# EAGLE design CPU (EAGLE 7.1.0)
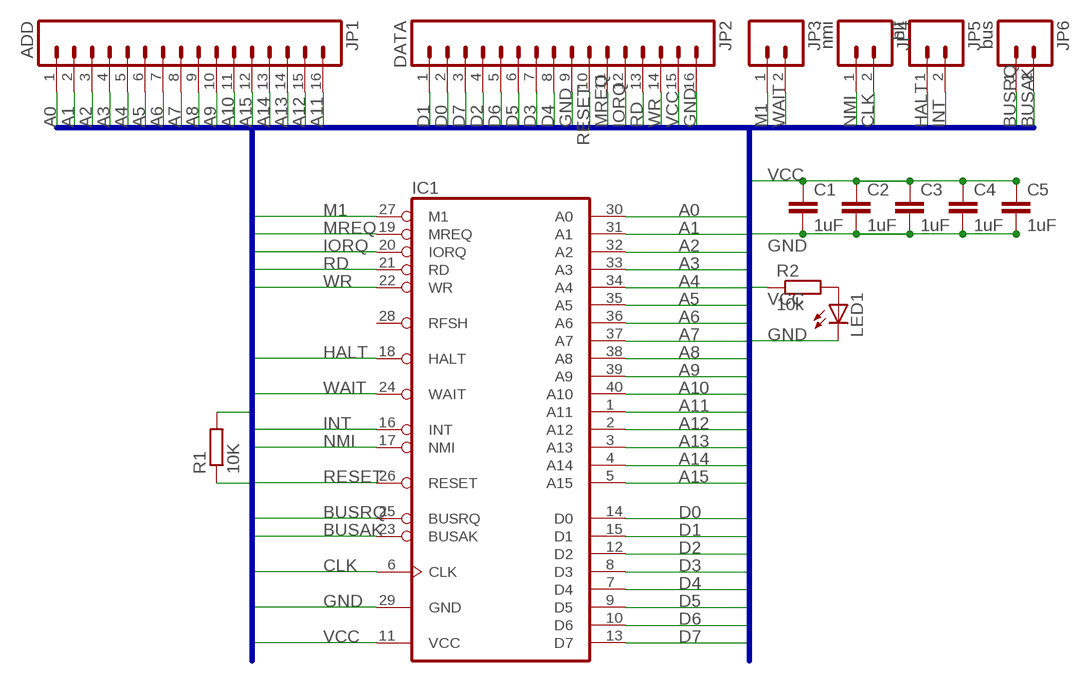
[diagram p0: schematic, sheet 1]

## Parts
C1  1uF  C-EUC0805  [C0805]
C2  1uF  C-EUC0805  [C0805]
C3  1uF  C-EUC0805  [C0805]
C4  1uF  C-EUC0805  [C0805]
C5  1uF  C-EUC0805  [C0805]
IC1  Z80CPU  [DIL40]
JP1  ADD  M16PTH  [1X16]
JP2  DATA  M16PTH  [1X16]
JP3  M02PTH  [1X02]
JP4  nmi  M02PTH  [1X02]
JP5  hlt  M02PTH  [1X02]
JP6  bus  M02PTH  [1X02]
LED1  LEDCHIP-LED0805  [CHIP-LED0805]
R1  10K  R-EU_M0805  [M0805]
R2  10k  R-EU_M0805  [M0805]

## Nets
A0: IC1.30(A0) JP1.1
A1: IC1.31(A1) JP1.2
A2: IC1.32(A2) JP1.3
A3: IC1.33(A3) JP1.4
A4: IC1.34(A4) JP1.5
A5: IC1.35(A5) JP1.6
A6: IC1.36(A6) JP1.7
A7: IC1.37(A7) JP1.8
A8: IC1.38(A8) JP1.9
A9: IC1.39(A9) JP1.10
A10: IC1.40(A10) JP1.11
A11: IC1.1(A11) JP1.16
A12: IC1.2(A12) JP1.15
A13: IC1.3(A13) JP1.14
A14: IC1.4(A14) JP1.13
A15: IC1.5(A15) JP1.12
BUSAK: IC1.23(BUSAK) JP6.2
BUSRQ: IC1.25(BUSRQ) JP6.1
CLK: IC1.6(CLK) JP4.2
D0: IC1.14(D0) JP2.2
D1: IC1.15(D1) JP2.1
D2: IC1.12(D2) JP2.4
D3: IC1.8(D3) JP2.7
D4: IC1.7(D4) JP2.8
D5: IC1.9(D5) JP2.6
D6: IC1.10(D6) JP2.5
D7: IC1.13(D7) JP2.3
GND: C1.2 C2.2 C3.2 C4.2 C5.2 IC1.29(GND) JP2.9 JP2.16 LED1.C
HALT: IC1.18(HALT) JP5.1
INT: IC1.16(INT) JP5.2
IORQ: IC1.20(IORQ) JP2.12
M1: IC1.27(M1) JP3.1
MREQ: IC1.19(MREQ) JP2.11
N$1: LED1.A R2.2
NMI: IC1.17(NMI) JP4.1
RD: IC1.21(RD) JP2.13
RESET: IC1.26(RESET) JP2.10 R1.1
VCC: C1.1 C2.1 C3.1 C4.1 C5.1 IC1.11(VCC) JP2.15 R1.2 R2.1
WAIT: IC1.24(WAIT) JP3.2
WR: IC1.22(WR) JP2.14
Unconnected: IC1.28(RFSH)

## Buses
A0,A1,A2,A3,A4,A5,A6,A7,A8,A9,A10,A11,A12,A13,A14,A15,D0,D1,D2,D3,D4,D5,D6,D7,GND,VCC,WR,RD,IORQ,MREQ,RESET,M1,CLK,WAIT,NMI,HALT,INT,BUSRQ,BUSAK

## Library data of the parts
C1-C5 = rcl:C-EU: CAPACITOR, European symbol
IC1 = zilog:Z80CPU: Z80 FAMILY DEVICE
JP1 JP2 = SparkFun-Connectors:M16: 1x16 .1" header
JP3-JP6 = SparkFun:M02: Header 2 Standard 2-pin 0.1" header. Use with straight break away headers (SKU : PRT-00116), right angle break away headers (PRT-00553), swiss pins (PRT-00743), machine pins (PRT-00117), and female headers (PRT-00115). Molex polarized connector foot print use with SKU : PRT-08233 with associated crimp pins and housings.
LED1 = adafruit:LED: LED OSRAM: - CHIPLED LG R971, LG N971, LY N971, LG Q971, LY Q971, LO R971, LY R971 LH N974, LH R974 LS Q976, LO Q976, LY Q976 LO Q996 - Hyper CHIPLED LW Q18S LB Q993, LB Q99A, LB R99A - SideLED LS A670, LO A670, LY A670, LG A670, LP A670 LB A673, LV A673, LT A673, LW A673 LH A674 LY A675 LS A676, LA A676, LO A676, LY A676, LW A676 LS A679, LY A679, LG A679 - Hyper Micro SIDELED® LS Y876, LA Y876, LO Y876, LY Y876 LT Y87S - SmartLED LW L88C, LW L88S LB L89C, LB L89S, LG L890 LS L89K, LO L89K, LY L89K LS L896, LA L896, LO L896, LY L896 - TOPLED LS T670, LO T670, LY T670, LG T670, LP T670 LSG T670, LSP T670, LSY T670, LOP T670, LYG T670 LG T671, LOG T671, LSG T671 LB T673, LV T673, LT T673, LW T673 LH T674 LS T676, LA T676, LO T676, LY T676, LB T676, LH T676, LSB T676, LW T676 LB T67C, LV T67C, LT T67C, LS T67K, LO T67K, LY T67K, LW E67C LS E67B, LA E67B, LO E67B, LY E67B, LB E67C, LV E67C, LT E67C LW T67C LS T679, LY T679, LG T679 LS T770, LO T770, LY T770, LG T770, LP T770 LB T773, LV T773, LT T773, LW T773 LH T774 LS E675, LA E675, LY E675, LS T675 LS T776, LA T776, LO T776, LY T776, LB T776 LHGB T686 LT T68C, LB T68C - Hyper Mini TOPLED® LB M676 - Mini TOPLED Santana® LG M470 LS M47K, LO M47K, LY M47K Source: http://www.osram.convergy.de/
R1 R2 = rcl:R-EU_: RESISTOR, European symbol

## Board
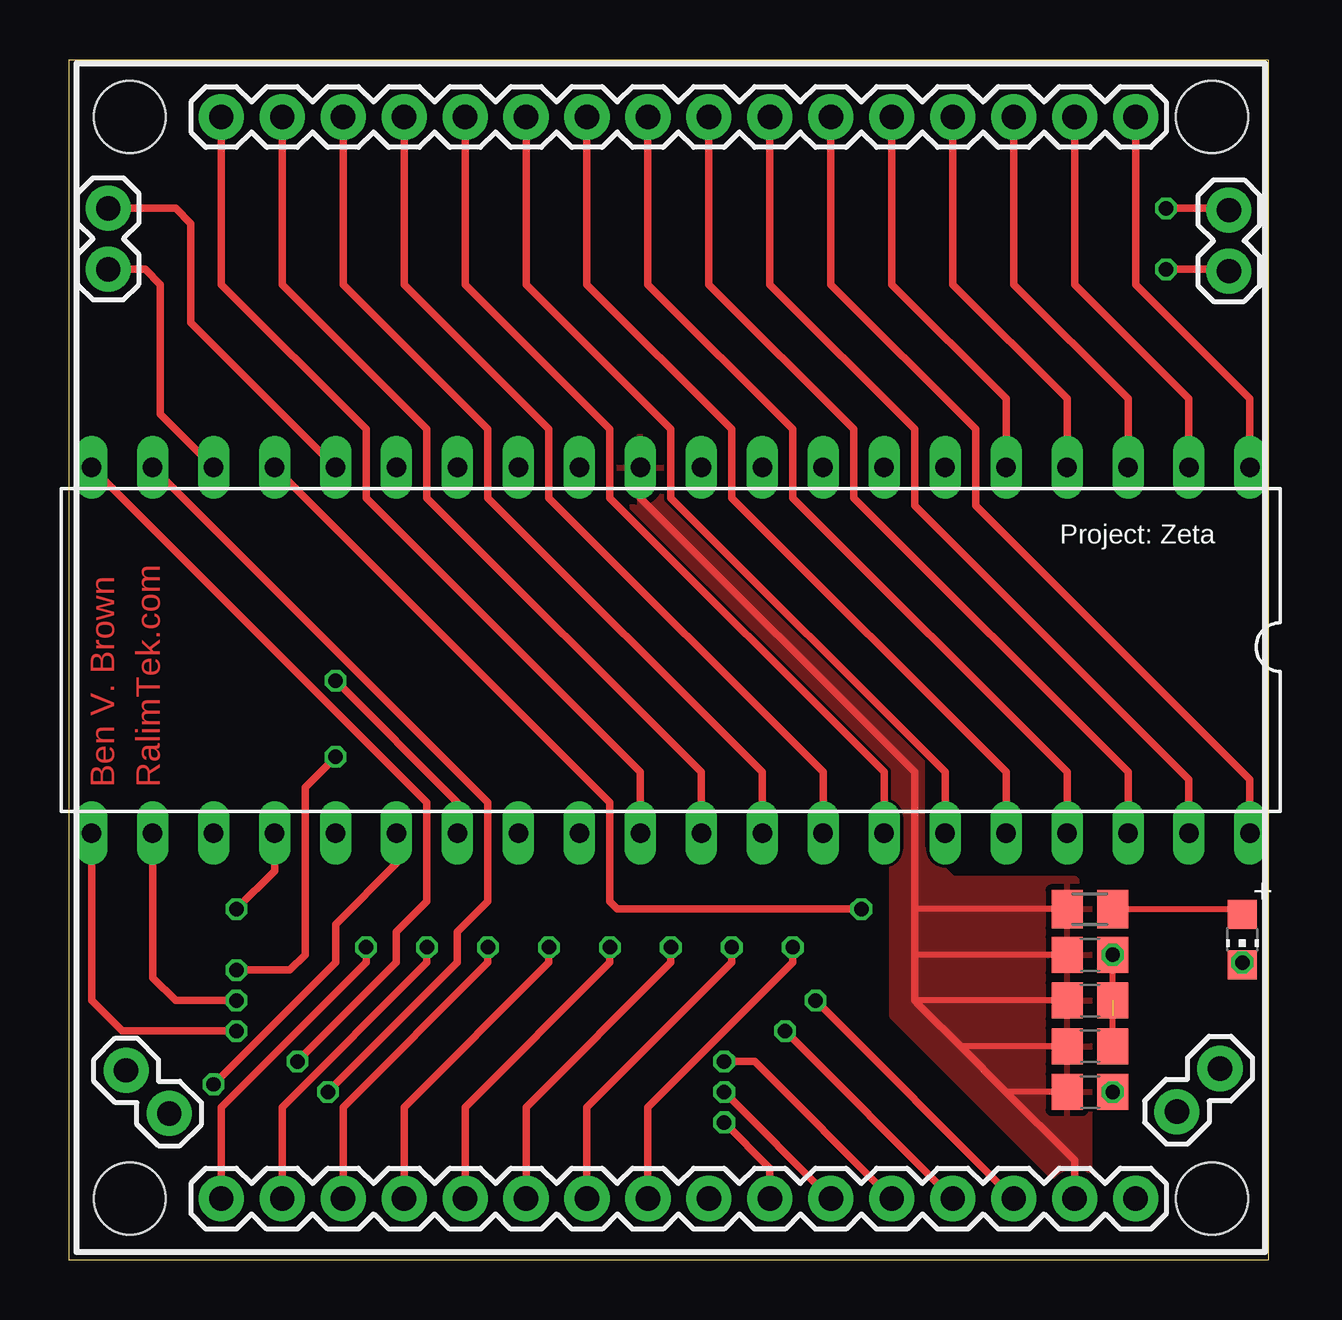
[diagram p1: board, top side]
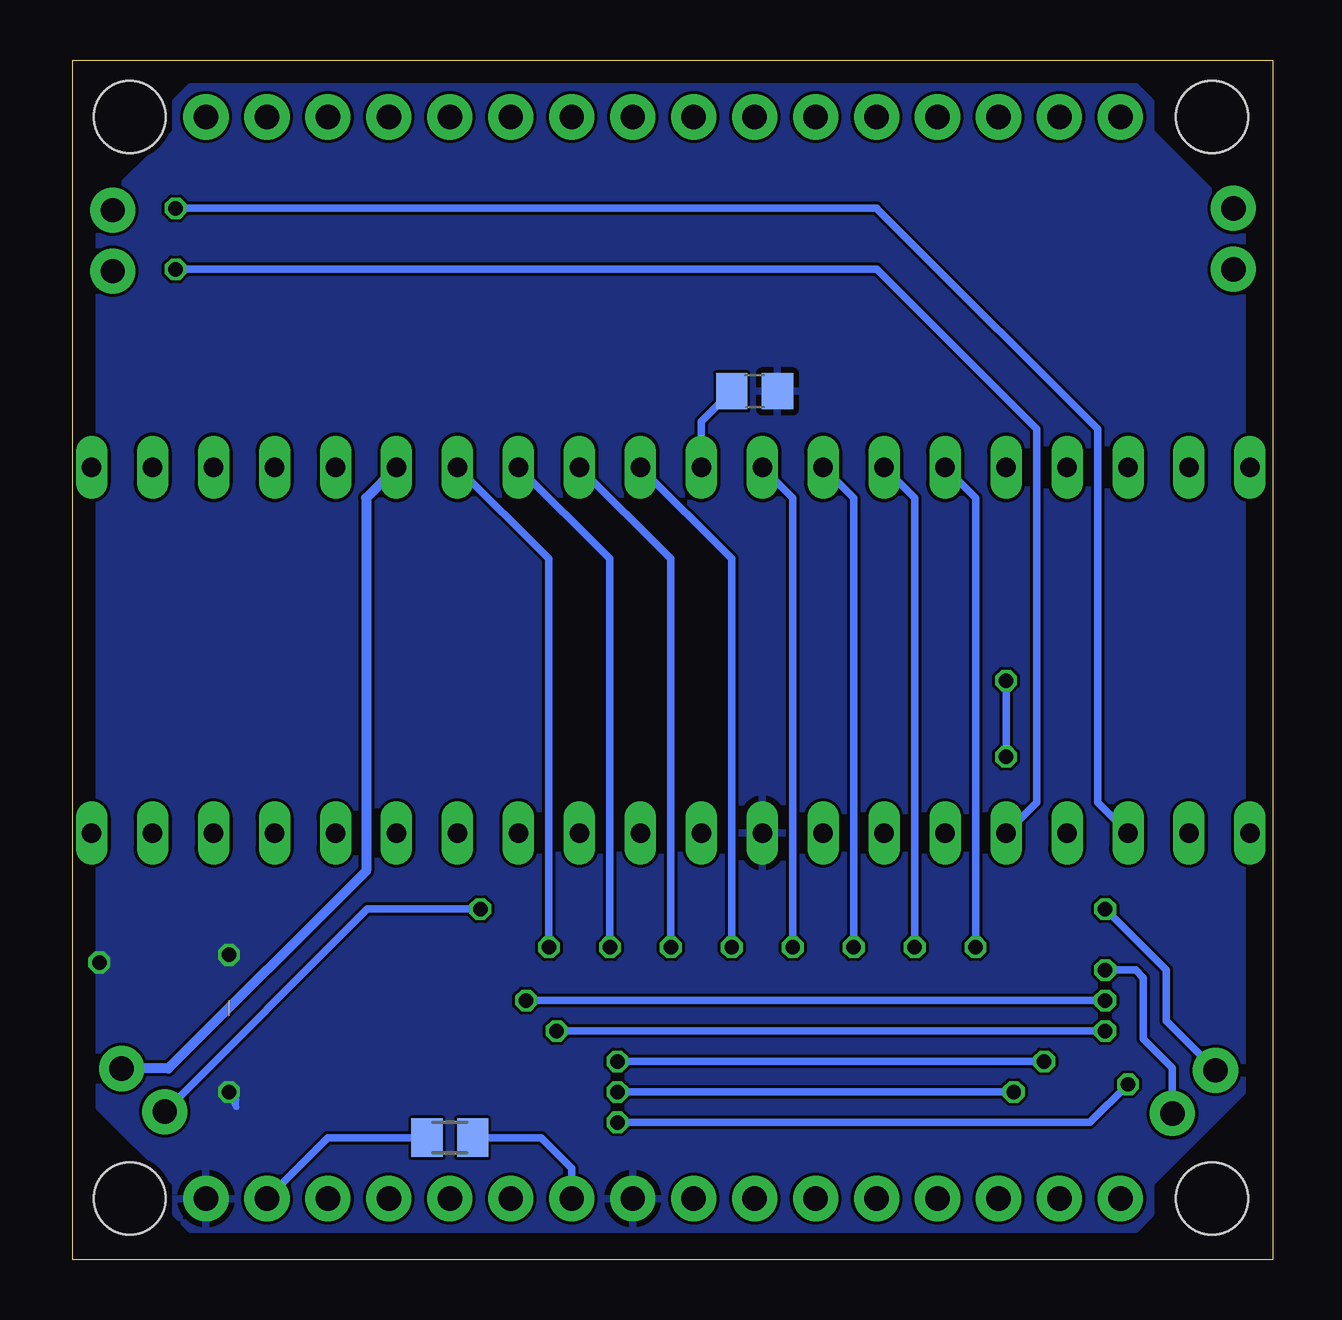
[diagram p2: board, bottom side, seen from below]

Size 50 x 50 mm. Coordinates in mm from the lower left corner, seen from the top.
Outline: 0,0 50,0 50,50 0,50 0,0
Copper layers (1*16): Top 0.035mm / dielectric 1.5mm / Bottom 0.035mm
Design rules "dirt_cheap_dirty_boards.v1": minimum track width 5mil, minimum drill 12mil, track to track 5mil, track to pad 5mil, pad to pad 5mil, via to via 5mil, smd to smd 0mil, copper to edge 10mil, drill to drill 10mil, minimum pad ring 10mil, minimum via ring 6mil, stop-mask expansion 2mil, vias tented up to drill 25mil, thermal gap 10mil
Holes 3 mm at 2.54,47.62 47.62,47.62 47.62,2.54 2.54,2.54

### Footprints (pad centres in the part's own frame; a part is rotated, then mirrored left to right if it is on the bottom)
C0805 = smd 1.3 x 1.5: 1 -0.95,0; 2 0.95,0
DIL40 = drill 0.813 long: 1 -24.13,-7.62; 2 -21.59,-7.62; 3 -19.05,-7.62; 4 -16.51,-7.62; 5 -13.97,-7.62; 6 -11.43,-7.62; 7 -8.89,-7.62; 8 -6.35,-7.62; 9 -3.81,-7.62; 10 -1.27,-7.62; 11 1.27,-7.62; 12 3.81,-7.62; 13 6.35,-7.62; 14 8.89,-7.62; 15 11.43,-7.62; 16 13.97,-7.62; 17 16.51,-7.62; 18 19.05,-7.62; 19 21.59,-7.62; 20 24.13,-7.62; 21 24.13,7.62; 22 21.59,7.62; 23 19.05,7.62; 24 16.51,7.62; 25 13.97,7.62; 26 11.43,7.62; 27 8.89,7.62; 28 6.35,7.62; 29 3.81,7.62; 30 1.27,7.62; 31 -1.27,7.62; 32 -3.81,7.62; 33 -6.35,7.62; 34 -8.89,7.62; 35 -11.43,7.62; 36 -13.97,7.62; 37 -16.51,7.62; 38 -19.05,7.62; 39 -21.59,7.62; 40 -24.13,7.62
1X16 = drill 1.016 pad 1.88: 1 0,0; 2 2.54,0; 3 5.08,0; 4 7.62,0; 5 10.16,0; 6 12.7,0; 7 15.24,0; 8 17.78,0; 9 20.32,0; 10 22.86,0; 11 25.4,0; 12 27.94,0; 13 30.48,0; 14 33.02,0; 15 35.56,0; 16 38.1,0
1X02 = drill 1.016 pad 1.88: 1 0,0; 2 2.54,0
CHIP-LED0805 = smd 1.2 x 1.2: A 0,-1.05; C 0,1.05
M0805 = smd 1.3 x 1.6: 1 -0.95,0; 2 0.95,0

### Placement (x,y rotation side)
C1  21.59,36.2 0 bottom
C2  42.55,6.99 0 top
C3  42.55,10.79 0 top
C4  42.55,12.7 0 top
C5  42.55,8.89 0 top
IC1  25.08,25.4 180 top
JP1  6.35,47.62 0 top
JP2  6.35,2.54 0 top
JP3  4.18,6.09 135 top
JP4  46.17,6.16 45 top
JP5  1.64,41.27 90 top
JP6  48.34,41.2 90 top
LED1  48.9,13.34 180 top
R1  34.29,5.08 180 bottom
R2  42.55,14.61 0 top

### Tracks (layer width: path | path; a pad name or v marks a point on that pad's centre or on a via)
A0
  Top 0.305: JP1.1 6.35,40.64 12.38,34.61 12.38,31.75 23.81,20.32 IC1.30
A1
  Top 0.305: JP1.2 8.89,40.64 14.92,34.61 14.92,31.75 26.35,20.32 IC1.31
A2
  Top 0.305: JP1.3 11.43,40.64 17.46,34.61 17.46,31.75 28.89,20.32 IC1.32
A3
  Top 0.305: JP1.4 13.97,40.64 20,34.61 20,31.75 31.43,20.32 IC1.33
A4
  Top 0.305: JP1.5 16.51,40.64 22.54,34.61 22.54,31.75 33.97,20.32 IC1.34
A5
  Top 0.305: JP1.6 19.05,40.64 25.08,34.61 25.08,31.75 36.51,20.32 IC1.35
A6
  Top 0.305: JP1.7 21.59,40.64 27.62,34.61 27.62,31.75 39.05,20.32 IC1.36
A7
  Top 0.305: JP1.8 24.13,40.64 30.16,34.61 30.16,31.75 41.59,20.32 IC1.37
A8
  Top 0.305: JP1.9 26.67,40.64 32.7,34.61 32.7,31.75 44.13,20.32 IC1.38
A9
  Top 0.305: JP1.10 29.21,40.64 35.24,34.61 35.24,31.43 46.67,20 IC1.39
A10
  Top 0.305: JP1.11 31.75,40.64 37.78,34.61 37.78,31.43 49.21,20 IC1.40
A11
  Top 0.305: IC1.1 49.21,35.88 44.45,40.64 JP1.16
A12
  Top 0.305: IC1.2 46.67,35.88 41.91,40.64 JP1.15
A13
  Top 0.305: IC1.3 44.13,35.88 39.37,40.64 JP1.14
A14
  Top 0.305: IC1.4 41.59,35.88 36.83,40.64 JP1.13
A15
  Top 0.305: IC1.5 39.05,35.88 34.29,40.64 JP1.12
BUSAK  (via drill 0.6)
  Top 0.305: JP6.2 48.26,43.81 v45.72,43.81
  Bottom 0.305: IC1.23 7.3,19.05 7.3,34.61 15.56,42.86 16.43,43.74 16.51,43.81 v45.72,43.81
BUSRQ  (via drill 0.6)
  Top 0.305: JP6.1 48.26,41.27 v45.72,41.27
  Bottom 0.305: IC1.25 9.84,19.05 9.84,34.61 16.51,41.27 v45.72,41.27
CLK
  Bottom 0.406: IC1.6 37.78,31.75 37.78,16.19 46.02,7.96 JP4.2
D0  (via drill 0.6)
  Top 0.305: JP2.2 8.89,6.35 14.92,12.38 v14.92,13.02
  Bottom 0.305: IC1.14 14.92,31.75 v14.92,13.02
D1  (via drill 0.6)
  Top 0.305: JP2.1 6.35,6.35 12.38,12.38 v12.38,13.02
  Bottom 0.305: IC1.15 12.38,31.75 v12.38,13.02
D2  (via drill 0.6)
  Top 0.305: JP2.4 13.97,6.35 20,12.38 v20,13.02
  Bottom 0.305: IC1.12 20,31.75 v20,13.02
D3  (via drill 0.6)
  Top 0.305: JP2.7 21.59,6.35 27.62,12.38 v27.62,13.02
  Bottom 0.305: IC1.8 27.62,29.21 v27.62,13.02
D4  (via drill 0.6)
  Top 0.305: JP2.8 24.13,6.35 30.16,12.38 v30.16,13.02
  Bottom 0.305: IC1.7 30.16,29.21 v30.16,13.02
D5  (via drill 0.6)
  Top 0.305: JP2.6 19.05,6.35 25.08,12.38 v25.08,13.02
  Bottom 0.305: IC1.9 25.08,29.21 v25.08,13.02
D6  (via drill 0.6)
  Top 0.305: JP2.5 16.51,6.35 22.54,12.38 v22.54,13.02
  Bottom 0.305: v22.54,13.02 22.54,18.41 22.54,19.05 22.54,29.21 IC1.10
D7  (via drill 0.6)
  Top 0.305: JP2.3 11.43,6.35 17.46,12.38 v17.46,13.02
  Bottom 0.305: IC1.13 17.46,31.75 v17.46,13.02
GND  (via drill 0.6)  (1 unrouted)
  Top 0.254: C2.2 | C4.2 C3.2 | LED1.C v48.9,12.38 | C5.2 43.49,10.16 43.5,10.16
  Bottom 0.254: C2.2 43.18,6.35 43.18,6.67 | v48.9,12.38 48.9,12.06
  other vias: 43.5,6.99 43.5,12.7
  pour Bottom: 1.27,6.99 5.08,3.17 5.08,1.91 5.71,1.27 45.09,1.27 45.72,1.91 45.72,3.17 48.9,6.35 48.9,43.81 45.72,46.99 45.72,48.26 45.09,48.9 5.71,48.9 5.08,48.26 5.08,46.99 1.27,43.18
HALT
  Top 0.305: IC1.18 3.81,35.24 3.81,40.64 3.17,41.27 JP5.1
INT
  Top 0.305: IC1.16 5.08,39.05 5.08,43.18 4.45,43.81 JP5.2
IORQ  (via drill 0.6)
  Top 0.305: IC1.20 14.92,19.05 14.92,14.92 13.65,13.65 13.65,12.38 v9.53,8.26 | JP2.12 28.57,8.26 v27.3,8.26
  Bottom 0.305: v27.3,8.26 v9.53,8.26
M1  (via drill 0.6)
  Top 0.305: IC1.27 16.19,19.05 v11.11,24.13 | v11.11,20.95 9.84,19.68 9.84,12.7 9.21,12.06 v6.99,12.06
  Bottom 0.305: v11.11,24.13 v11.11,20.95 | v6.99,12.06 5.71,12.06 5.4,11.75 5.4,9.21 4.18,7.99 JP3.1
MREQ  (via drill 0.6)
  Top 0.305: IC1.19 17.46,19.05 17.46,14.92 16.19,13.65 16.19,12.38 v10.79,6.99 | JP2.11 v27.3,6.99
  Bottom 0.305: v27.3,6.99 v10.79,6.99
N$1
  Top 0.254: R2.2 48.67,14.61 LED1.A
NMI  (via drill 0.6)
  Top 0.305: IC1.17 22.54,19.05 22.54,14.92 22.86,14.61 v33.02,14.61
  Bottom 0.305: JP4.1 37.73,14.61 v33.02,14.61
RD  (via drill 0.6)
  Top 0.305: IC1.21 0.95,10.79 2.22,9.53 v6.99,9.53 | JP2.13 v29.84,9.53
  Bottom 0.305: v6.99,9.53 28.57,9.53 v29.84,9.53
RESET  (via drill 0.6)
  Top 0.305: JP2.10 29.21,3.81 v27.3,5.71 | v6.03,7.3 11.11,12.38 11.11,13.97 13.65,16.51 IC1.26
  Bottom 0.305: v27.3,5.71 7.62,5.71 v6.03,7.3 | R1.1 30.48,5.08 29.21,3.81 JP2.10
VCC
  Top 0.254: R2.1 35.24,14.61 | C4.1 35.24,12.7 | C3.1 35.4,10.79 35.4,10.64 | C5.1 37.31,8.89 37.31,8.73 | C2.1 39.05,6.99 38.89,7.14
  Top 0.305: IC1.11 23.81,31.75 35.24,20.32 35.24,14.61 35.24,12.7 35.24,10.79 35.4,10.64 37.31,8.73 38.89,7.14 41.91,4.13 JP2.15
  Bottom 0.305: C1.1 23.81,34.92 IC1.11 | R1.2 39.37,5.08 JP2.15
  pour Top: 41.91,2.54 42.55,3.17 42.55,15.24 41.91,15.88 36.83,15.88 35.56,17.14 35.56,21.59 24.77,32.38 24.77,33.66 24.13,34.29 23.5,34.29 22.86,33.66 22.86,31.75 34.29,20.32 34.29,10.16
WAIT  (via drill 0.6)
  Top 0.305: IC1.24 8.57,16.19 v6.99,14.61
  Bottom 0.305: JP3.2 4.45,9.94 4.45,12.06 v6.99,14.61
WR  (via drill 0.6)
  Top 0.305: IC1.22 3.49,11.75 4.45,10.79 v6.99,10.79 | JP2.14 v31.11,10.79
  Bottom 0.305: v6.99,10.79 28.57,10.79 v31.11,10.79

### Text on the board
Top: Ben V. Brown | RalimTek.com
tPlace: Project: Zeta